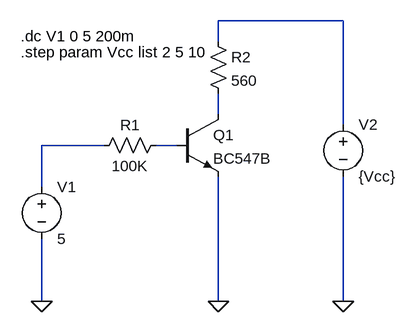
[diagram p0: schematic ej4.asc]
ej4.asc, the LTspice schematic file:
Version 4.1
SHEET 1 880 680
WIRE 464 -80 272 -80
WIRE 272 -48 272 -80
WIRE 272 64 272 32
WIRE 464 80 464 -80
WIRE 96 112 0 112
WIRE 208 112 176 112
WIRE 0 176 0 112
WIRE 0 352 0 256
WIRE 272 352 272 160
WIRE 464 352 464 160
FLAG 464 352 0
FLAG 272 352 0
FLAG 0 352 0
SYMBOL res 192 96 R90
WINDOW 0 0 56 VBottom 2
WINDOW 3 32 56 VTop 2
SYMATTR InstName R1
SYMATTR Value 100K
SYMBOL res 256 -64 R0
SYMATTR InstName R2
SYMATTR Value 560
SYMBOL npn 208 64 R0
SYMATTR InstName Q1
SYMATTR Value BC547B
SYMBOL voltage 0 160 R0
WINDOW 123 0 0 Left 0
WINDOW 39 0 0 Left 0
SYMATTR InstName V1
SYMATTR Value 5
SYMBOL voltage 464 64 R0
WINDOW 123 0 0 Left 0
WINDOW 39 0 0 Left 0
SYMATTR InstName V2
SYMATTR Value {Vcc}
TEXT -32 -56 Left 2 !.dc V1 0 5 200m
TEXT -32 -32 Left 2 !.step param Vcc list 2 5 10

The netlist it stands for:
* ej4.asc
R1 N004 N003 100K
R2 N001 N002 560
Q1 N002 N004 0 0 BC547B
V1 N003 0 5
V2 N001 0 {Vcc}
.model NPN NPN
.model PNP PNP
.lib standard.bjt
.dc V1 0 5 200m
.step param Vcc list 2 5 10
.backanno
.end